# EAGLE design 5x_Piezo_Hoeller_DS (EAGLE 9.1.3)
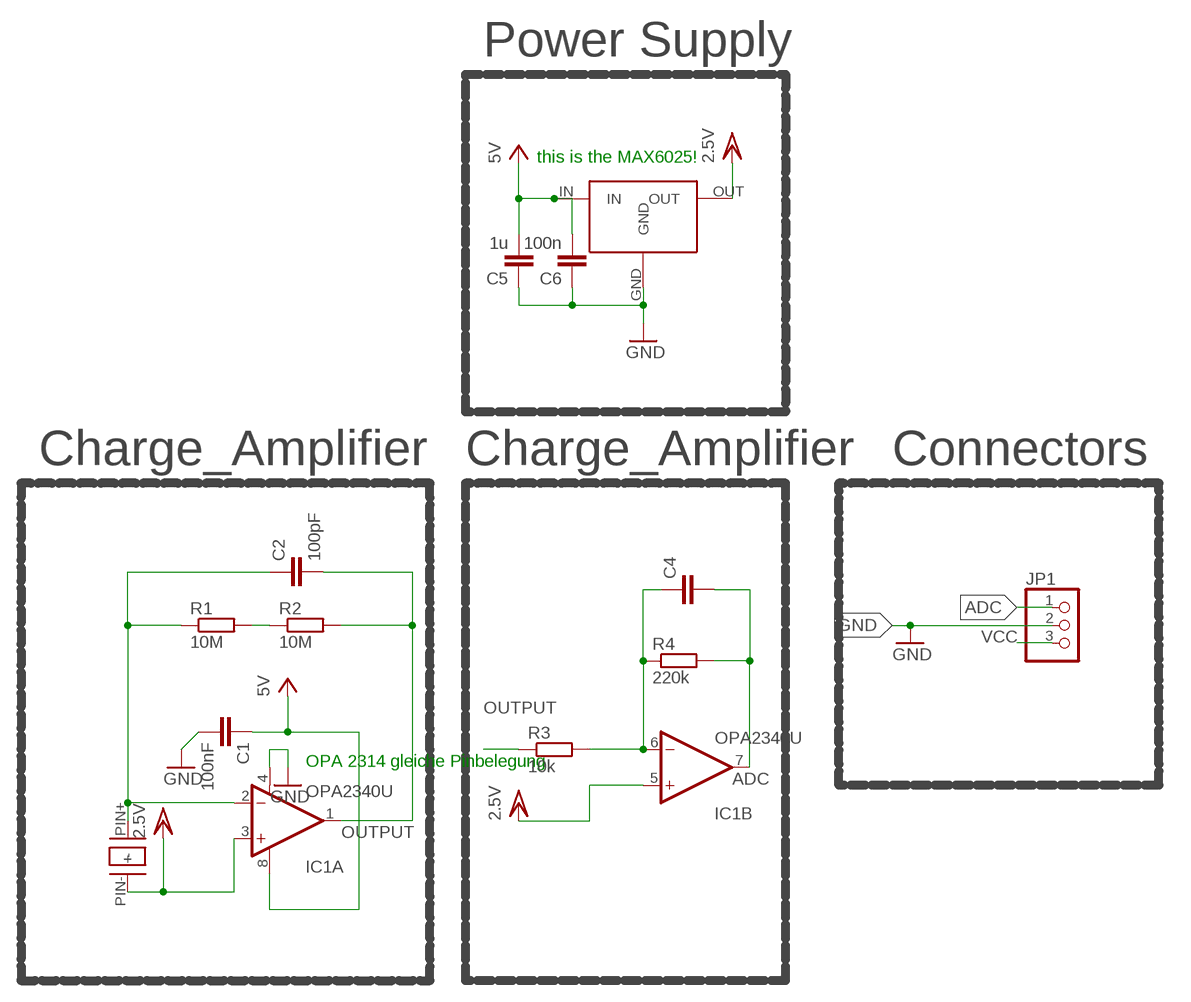
[diagram p0: schematic, sheet 1]

## Parts
C1  100nF  C-EUC0603  [C0603]
C2  100pF  C-EUC0603  [C0603]
C4  C-EUC0603  [C0603]
C5  1u  C-EUC0603  [C0603]
C6  100n  C-EUC0603  [C0603]
IC1  OPA2340U  [SO08]
JP1  PINHD-1X3  [1X03]
R1  10M  R-EU_R0603  [R0603]
R2  10M  R-EU_R0603  [R0603]
R3  10k  R-EU_R0603  [R0603]
R4  220k  R-EU_R0603  [R0603]
U$1  MAX6018X  [SOT-3]
U$2  10MMSCHEIBE  [10MM_SCHEIBE]

## Nets
ADC: C4.2 IC1.7(B:OUT) JP1.1 R4.2
GND: C1.2 C5.1 C6.1 IC1.4(A:V-) JP1.2 U$1.GND
N$1 [dünn]: C2.1 IC1.2(A:-IN) R1.1 U$2.PIN+(+)
N$3: R1.2 R2.1
N$5 [dünn]: C4.1 IC1.6(B:-IN) R3.2 R4.1
OUTPUT: C2.2 IC1.1(A:OUT) R2.2 R3.1
VCC: C1.1 C5.2 C6.2 IC1.8(A:V+) JP1.3 U$1.IN ; supply symbol labelled 5V
VCC/2: IC1.3(A:+IN) IC1.5(B:+IN) U$1.OUT U$2.PIN-(-) ; supply symbol labelled 2.5V

## Notes on the sheet
- Power Supply
- this is the MAX6025!
- Charge_Amplifier | Charge_Amplifier | Connectors
- OPA 2314 gleiche Pinbelegung

## Library data of the parts
C1 C2 C5 C6 = rcl:C-EU: CAPACITOR, European symbol
C4 = rcl:C-EU: CAPACITOR, European symbol; SPICEPREFIX: C
IC1 = burr-brown:OPA2340: Single-Supply, Rail-to-Rail Operational Amplifiers MicroAmplifier(TM) Series; Product Folder:OPA2340; MF: TEXAS INSTRUMENTS; MPN: OPA2340UA; OC_FARNELL: 1101541; OC_NEWARK: 36K7581
JP1 = pinhead:PINHD-1X3: PIN HEADER
R1-R4 = rcl:R-EU_: RESISTOR, European symbol
U$1 = MAX6018X:MAX6018X
U$2 = Pulswellenerfassung:10MMSCHEIBE

## Net classes
0 default: width 0.406 mm, drill 0.508 mm, clearance 0.254 mm
1 dünn: width 0.254 mm, drill 0.381 mm, clearance 0.127 mm

## Board
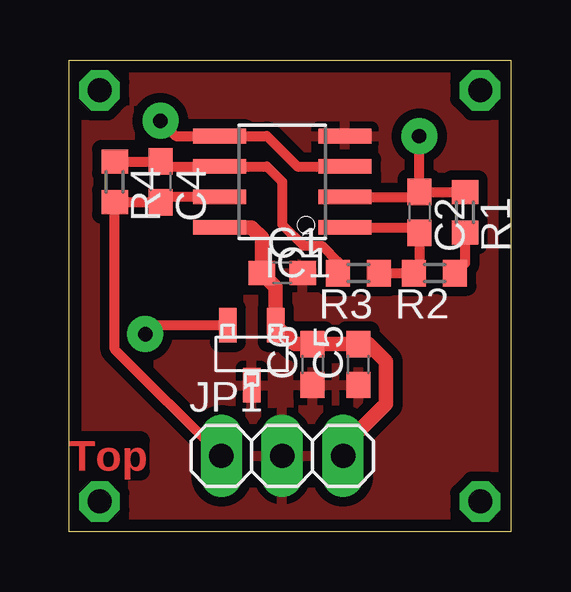
[diagram p1: board, top side]
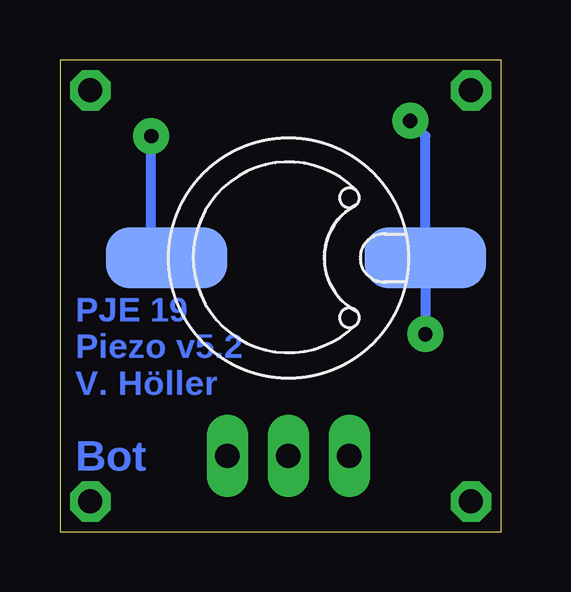
[diagram p2: board, bottom side, seen from below]

Size 18.41 x 19.68 mm. Coordinates in mm from the lower left corner, seen from the top.
Outline: 0,19.68 18.41,19.68 18.41,0 0,0 0,19.68
Copper layers (1*16): Top 0.035mm / dielectric 1.5mm / Bottom 0.035mm
Design rules "EMSP_SMD_DRC_2019": minimum track width 13mil, minimum drill 0.6mm, track to track 11mil, track to pad 0.25mm, pad to pad 0.25mm, via to via 11mil, smd to smd 8mil, copper to edge 20mil, drill to drill 16mil, minimum pad ring 12mil, minimum via ring 12mil, stop-mask expansion 4mil, vias tented up to drill 0mil, thermal gap 12mil

### Footprints (pad centres in the part's own frame; a part is rotated, then mirrored left to right if it is on the bottom)
C0603 = smd 1.1 x 1: 1 -0.85,0; 2 0.85,0
SO08 = smd 0.61 x 2.21: 1 -1.905,-2.616; 2 -0.635,-2.616; 3 0.635,-2.616; 4 1.905,-2.616; 5 1.905,2.616; 6 0.635,2.616; 7 -0.635,2.616; 8 -1.905,2.616
1X03 = drill 1.016 long: 1 -2.54,0; 2 0,0; 3 2.54,0
R0603 = smd 1 x 1.1: 1 -0.85,0; 2 0.85,0
SOT-3 = smd 0.711 x 1.422: GND 0,1.5; IN -1,-1; OUT 1,-1
10MM_SCHEIBE = smd 2.54 x 5.08: PIN+ 0,-5.08; PIN- 0,5.715

### Placement (x,y rotation side)
C1  8.89,10.79 0 top
C2  14.61,13.34 270 top
C4  3.81,14.61 270 top
C5  12.06,6.99 90 top
C6  10.16,6.99 90 top
IC1  8.89,14.61 90 top
JP1  8.89,3.17 0 top
R1  16.51,13.34 270 top
R2  15.24,10.79 180 top
R3  12.06,10.79 180 top
R4  1.91,14.61 270 top
U$1  7.62,7.62 180 top
U$2  8.89,11.43 270 bottom

### Tracks (layer width: path | path; a pad name or v marks a point on that pad's centre or on a via)
ADC
  Top 0.406: IC1.7 4.03,13.97 C4.2 R4.2 1.91,7.62 JP1.1
GND
  pour Top (isolate 0.4): 0,19.68 18.41,19.68 18.41,0 0,0
N$1  (via drill 0.6 pad 1.5)
  Top 0.406: IC1.2 14.39,13.97 C2.1 | C2.1 R1.1 | C2.1 v14.61,16.51
  Bottom 0.406: U$2.PIN+ 14.61,12.06 v14.61,16.51
N$2  (via drill 1 pad 1.5)
  other vias: 1.27,18.41
N$3
  Top 0.406: R1.2 16.51,11.21 R2.1
N$4  (via drill 1 pad 1.5)
  other vias: 17.14,18.41
N$5
  Top 0.406: R4.1 C4.1 4.03,15.24 IC1.6 8.26,15.24 8.89,14.61 8.89,12.83 9.78,11.94 10.54,11.94 11.21,11.26 R3.2
N$6  (via drill 1 pad 1.5)
  other vias: 17.14,1.27
N$7  (via drill 1 pad 1.5)
  other vias: 1.27,1.27
OUTPUT
  Top 0.406: R3.1 R2.2 14.61,11.01 C2.2 14.39,12.7 IC1.1
VCC
  Top 0.61: JP1.3 11.43,3.56 13.21,5.33 13.21,7.11 12.48,7.84 C5.2 C6.2 9.4,7.84 U$1.IN 8.62,10.21 C1.1 8.04,12.28 7.62,12.7 IC1.8
VCC/2  (via drill 0.6 pad 1.5)
  Top 0.406: v3.81,17.14 4.45,16.51 IC1.5 8.26,16.51 9.53,15.24 IC1.3 | U$1.OUT 3.54,8.62 v3.17,8.26
  Bottom 0.406: v3.17,8.26 U$2.PIN- 3.17,16.51 v3.81,17.14

### Text on the board
Top: Top
Bottom: PJE 19 / Piezo v5.2 / V. Höller | Bot
tStop: Elektromechanische Pulswellenrfassung 2016 | Version 4.0 | Tim Hegemann